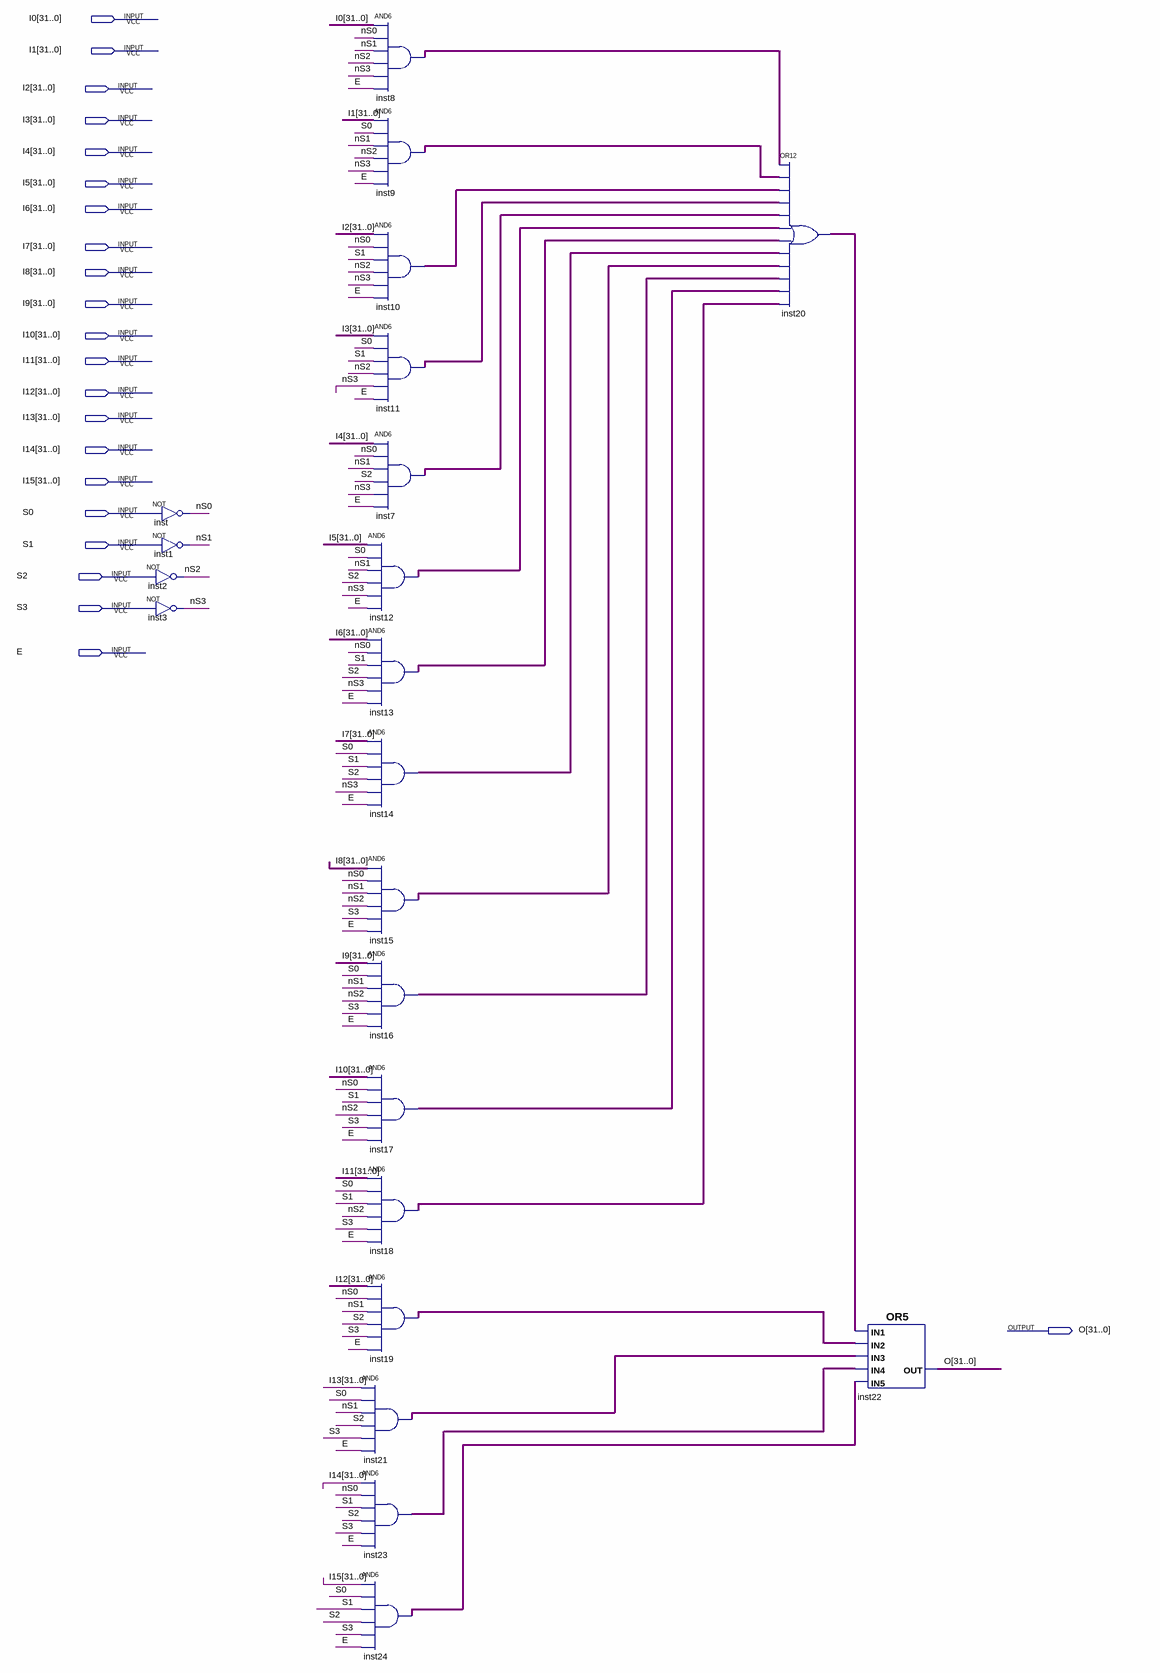
[diagram p0: schematic sheet]
// Quartus schematic MUX16_32.bdf as structural Verilog: 22 symbols, 22 pins
module MUX16_32 (
  input  [31:0] I0,
  input  [31:0] I1,
  input  [31:0] I2,
  input  [31:0] I3,
  input  [31:0] I4,
  input  [31:0] I5,
  input  [31:0] I6,
  input  [31:0] I7,
  input  [31:0] I8,
  input  [31:0] I9,
  input  [31:0] I10,
  input  [31:0] I11,
  input  [31:0] I12,
  input  [31:0] I13,
  input  [31:0] I14,
  input  [31:0] I15,
  input  S0,
  input  S1,
  input  S2,
  input  S3,
  input  E,
  output [31:0] O
);

  wire nS0, nS1, nS2, nS3;
  wire [31:0] inst7_out, inst8_out, inst9_out, inst10_out, inst11_out, inst12_out, inst13_out, inst14_out,
       inst15_out, inst16_out, inst17_out, inst18_out, inst19_out, inst20_out, inst21_out, inst23_out,
       inst24_out;

  not inst (nS0, S0);
  not inst1 (nS1, S1);
  not inst2 (nS2, S2);
  not inst3 (nS3, S3);
  assign inst8_out = I0 & {32{nS0}} & {32{nS1}} & {32{nS2}} & {32{nS3}} & {32{E}};  // AND6 inst8, 32 bits wide
  assign inst9_out = I1 & {32{S0}} & {32{nS1}} & {32{nS2}} & {32{nS3}} & {32{E}};  // AND6 inst9, 32 bits wide
  assign inst10_out = I2 & {32{nS0}} & {32{S1}} & {32{nS2}} & {32{nS3}} & {32{E}};  // AND6 inst10, 32 bits wide
  assign inst11_out = I3 & {32{S0}} & {32{S1}} & {32{nS2}} & {32{nS3}} & {32{E}};  // AND6 inst11, 32 bits wide
  assign inst7_out = I4 & {32{nS0}} & {32{nS1}} & {32{S2}} & {32{nS3}} & {32{E}};  // AND6 inst7, 32 bits wide
  assign inst12_out = I5 & {32{S0}} & {32{nS1}} & {32{S2}} & {32{nS3}} & {32{E}};  // AND6 inst12, 32 bits wide
  assign inst13_out = I6 & {32{nS0}} & {32{S1}} & {32{S2}} & {32{nS3}} & {32{E}};  // AND6 inst13, 32 bits wide
  assign inst14_out = I7 & {32{S0}} & {32{S1}} & {32{S2}} & {32{nS3}} & {32{E}};  // AND6 inst14, 32 bits wide
  assign inst15_out = I8 & {32{nS0}} & {32{nS1}} & {32{nS2}} & {32{S3}} & {32{E}};  // AND6 inst15, 32 bits wide
  assign inst16_out = I9 & {32{S0}} & {32{nS1}} & {32{nS2}} & {32{S3}} & {32{E}};  // AND6 inst16, 32 bits wide
  assign inst17_out = I10 & {32{nS0}} & {32{S1}} & {32{nS2}} & {32{S3}} & {32{E}};  // AND6 inst17, 32 bits wide
  assign inst18_out = I11 & {32{S0}} & {32{S1}} & {32{nS2}} & {32{S3}} & {32{E}};  // AND6 inst18, 32 bits wide
  assign inst19_out = I12 & {32{nS0}} & {32{nS1}} & {32{S2}} & {32{S3}} & {32{E}};  // AND6 inst19, 32 bits wide
  assign inst21_out = I13 & {32{S0}} & {32{nS1}} & {32{S2}} & {32{S3}} & {32{E}};  // AND6 inst21, 32 bits wide
  assign inst23_out = I14 & {32{nS0}} & {32{S1}} & {32{S2}} & {32{S3}} & {32{E}};  // AND6 inst23, 32 bits wide
  assign inst24_out = I15 & {32{S0}} & {32{S1}} & {32{S2}} & {32{S3}} & {32{E}};  // AND6 inst24, 32 bits wide
  assign inst20_out = inst8_out | inst9_out | inst10_out | inst11_out | inst7_out | inst12_out | inst13_out | inst14_out | inst15_out | inst16_out | inst17_out | inst18_out;  // OR12 inst20, 32 bits wide
  assign O = inst20_out | inst19_out | inst21_out | inst23_out | inst24_out;  // OR5 inst22, 32 bits wide
endmodule
